# Altium schematic sheet INA219Input.SchDoc
size A4
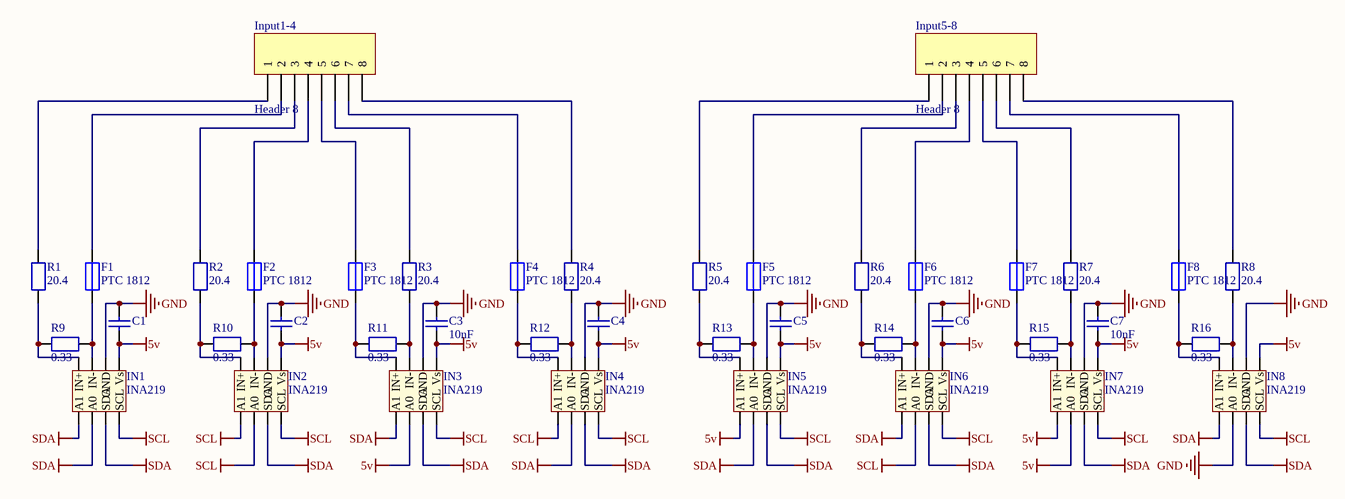
[diagram p0: INA219Input.SchDoc]

## Parts
C1  (no value)  [1" ceramic Radial Cap]
C2  (no value)  [1" ceramic Radial Cap]
C3  10nF  [1" ceramic Radial Cap]
C4  (no value)  [1" ceramic Radial Cap]
C5  (no value)  [1" ceramic Radial Cap]
C6  (no value)  [1" ceramic Radial Cap]
C7  10nF  [1" ceramic Radial Cap]
F1  PTC 1812  [0ZCG PTC 1812]
F2  PTC 1812  [0ZCG PTC 1812]
F3  PTC 1812  [0ZCG PTC 1812]
F4  PTC 1812  [0ZCG PTC 1812]
F5  PTC 1812  [0ZCG PTC 1812]
F6  PTC 1812  [0ZCG PTC 1812]
F7  PTC 1812  [0ZCG PTC 1812]
F8  PTC 1812  [0ZCG PTC 1812]
IN1  INA219  [INA219-D-SOIC]
IN2  INA219  [INA219-D-SOIC]
IN3  INA219  [INA219-D-SOIC]
IN4  INA219  [INA219-D-SOIC]
IN5  INA219  [INA219-D-SOIC]
IN6  INA219  [INA219-D-SOIC]
IN7  INA219  [INA219-D-SOIC]
IN8  INA219  [INA219-D-SOIC]
Input1-4  Header 8  [HDR1X8]
Input5-8  Header 8  [HDR1X8]
R1  20.4  [Axial 0.85 5W]
R2  20.4  [Axial 0.85 5W]
R3  20.4  [Axial 0.85 5W]
R4  20.4  [Axial 0.85 5W]
R5  20.4  [Axial 0.85 5W]
R6  20.4  [Axial 0.85 5W]
R7  20.4  [Axial 0.85 5W]
R8  20.4  [Axial 0.85 5W]
R9  0.33  [1206 SMD 1/4W]
R10  0.33  [1206 SMD 1/4W]
R11  0.33  [1206 SMD 1/4W]
R12  0.33  [1206 SMD 1/4W]
R13  0.33  [1206 SMD 1/4W]
R14  0.33  [1206 SMD 1/4W]
R15  0.33  [1206 SMD 1/4W]
R16  0.33  [1206 SMD 1/4W]

## Nets
5v: C1.1 C2.1 C3.1 C4.1 C5.1 C6.1 C7.1 IN1.Vs IN2.Vs IN3.A0 IN3.Vs IN4.Vs IN5.A1 IN5.Vs IN6.Vs IN7.A0 IN7.A1 IN7.Vs IN8.Vs
GND: C1.2 C2.2 C3.2 C4.2 C5.2 C6.2 C7.2 IN1.GND IN2.GND IN3.GND IN4.GND IN5.GND IN6.GND IN7.GND IN8.A0 IN8.GND
SCL: IN1.SCL IN2.A0 IN2.A1 IN2.SCL IN3.SCL IN4.A1 IN4.SCL IN5.SCL IN6.A0 IN6.SCL IN7.SCL IN8.SCL
SDA: IN1.A0 IN1.A1 IN1.SDA IN2.SDA IN3.A1 IN3.SDA IN4.A0 IN4.SDA IN5.A0 IN5.SDA IN6.A1 IN6.SDA IN7.SDA IN8.A1 IN8.SDA
NetF1_1: F1.1 IN1.IN- R9.1
NetF1_2: F1.2 Input1-4.2
NetF2_1: F2.1 IN2.IN- R10.1
NetF2_2: F2.2 Input1-4.4
NetF3_1: F3.1 IN3.IN+ R11.2
NetF3_2: F3.2 Input1-4.5
NetF4_1: F4.1 IN4.IN+ R12.2
NetF4_2: F4.2 Input1-4.7
NetF5_1: F5.1 IN5.IN- R13.1
NetF5_2: F5.2 Input5-8.2
NetF6_1: F6.1 IN6.IN- R14.1
NetF6_2: F6.2 Input5-8.4
NetF7_1: F7.1 IN7.IN+ R15.2
NetF7_2: F7.2 Input5-8.5
NetF8_1: F8.1 IN8.IN+ R16.2
NetF8_2: F8.2 Input5-8.7
NetIN1_IN+: IN1.IN+ R1.1 R9.2
NetIN2_IN+: IN2.IN+ R2.1 R10.2
NetIN3_IN-: IN3.IN- R3.1 R11.1
NetIN4_IN-: IN4.IN- R4.1 R12.1
NetIN5_IN+: IN5.IN+ R5.1 R13.2
NetIN6_IN+: IN6.IN+ R6.1 R14.2
NetIN7_IN-: IN7.IN- R7.1 R15.1
NetIN8_IN-: IN8.IN- R8.1 R16.1
NetInput1-4_1: Input1-4.1 R1.2
NetInput1-4_3: Input1-4.3 R2.2
NetInput1-4_6: Input1-4.6 R3.2
NetInput1-4_8: Input1-4.8 R4.2
NetInput5-8_1: Input5-8.1 R5.2
NetInput5-8_3: Input5-8.3 R6.2
NetInput5-8_6: Input5-8.6 R7.2
NetInput5-8_8: Input5-8.8 R8.2

## Library data of the parts
C1-C7 = 1" ceramic Radial Cap
F1-F8 = PTC 1812 Bel Fuse
IN1-IN8 = INA219-D-SOIC
Input1-4 Input5-8 = Header 8: Header, 8-Pin; LatestRevisionDate: 17-Jul-2002; LatestRevisionNote: Re-released for DXP Platform.; Publisher: Altium Limited
R1-R8 = Axial 0.85" 5W
R9-R16 = 1206 SMD 1/4W